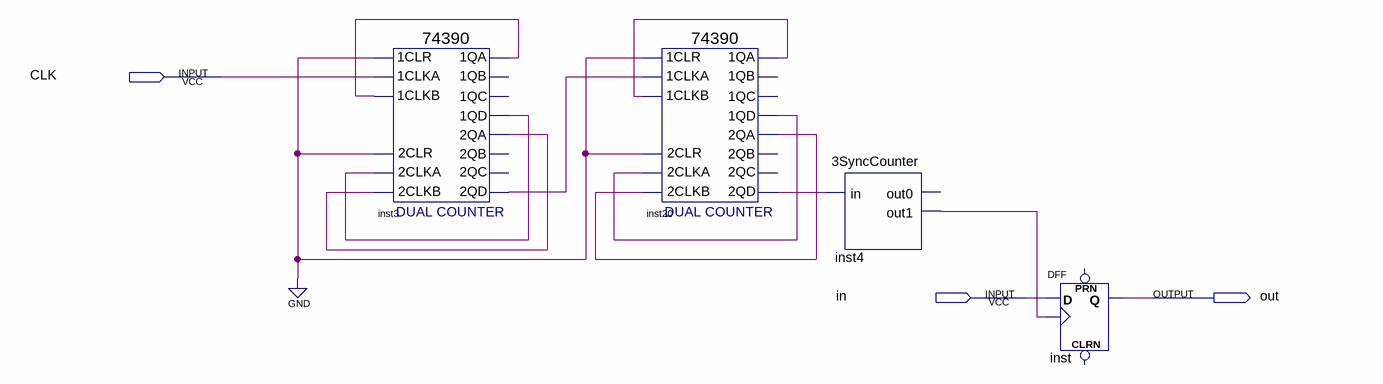
[diagram p0: schematic sheet]
// Quartus schematic PreventChatter.bdf as structural Verilog: 4 symbols, 3 pins
module PreventChatter (
  input  CLK,
  input  in,
  output out
);

  wire inst3_1qa, inst3_1qd, inst3_2qa, inst3_2qd, inst4_out1, inst20_1qa, inst20_1qd, inst20_2qa, inst20_2qd;

  \74390  inst3 (
    .\2CLKA (inst3_1qd), .\2CLR (1'b0), .\2CLKB (inst3_2qa), .\1CLR (1'b0), .\1CLKA (CLK),
    .\1CLKB (inst3_1qa), .\1QA (inst3_1qa), .\1QD (inst3_1qd), .\2QA (inst3_2qa), .\2QD (inst3_2qd));  // open: 1QB, 1QC, 2QB, 2QC
  \74390  inst20 (
    .\2CLKA (inst20_1qd), .\2CLR (1'b0), .\2CLKB (inst20_2qa), .\1CLR (1'b0), .\1CLKA (inst3_2qd),
    .\1CLKB (inst20_1qa), .\1QA (inst20_1qa), .\1QD (inst20_1qd), .\2QA (inst20_2qa), .\2QD (inst20_2qd));  // open: 1QB, 1QC, 2QB, 2QC
  \3SyncCounter  inst4 (.in(inst20_2qd), .out1(inst4_out1));  // open: out0
  DFF inst (.CLK(inst4_out1), .D(in), .Q(out));  // open: CLRN, PRN
endmodule
